# EAGLE design MinieasyMySens-V02-Build008 (EAGLE 7.6.0)
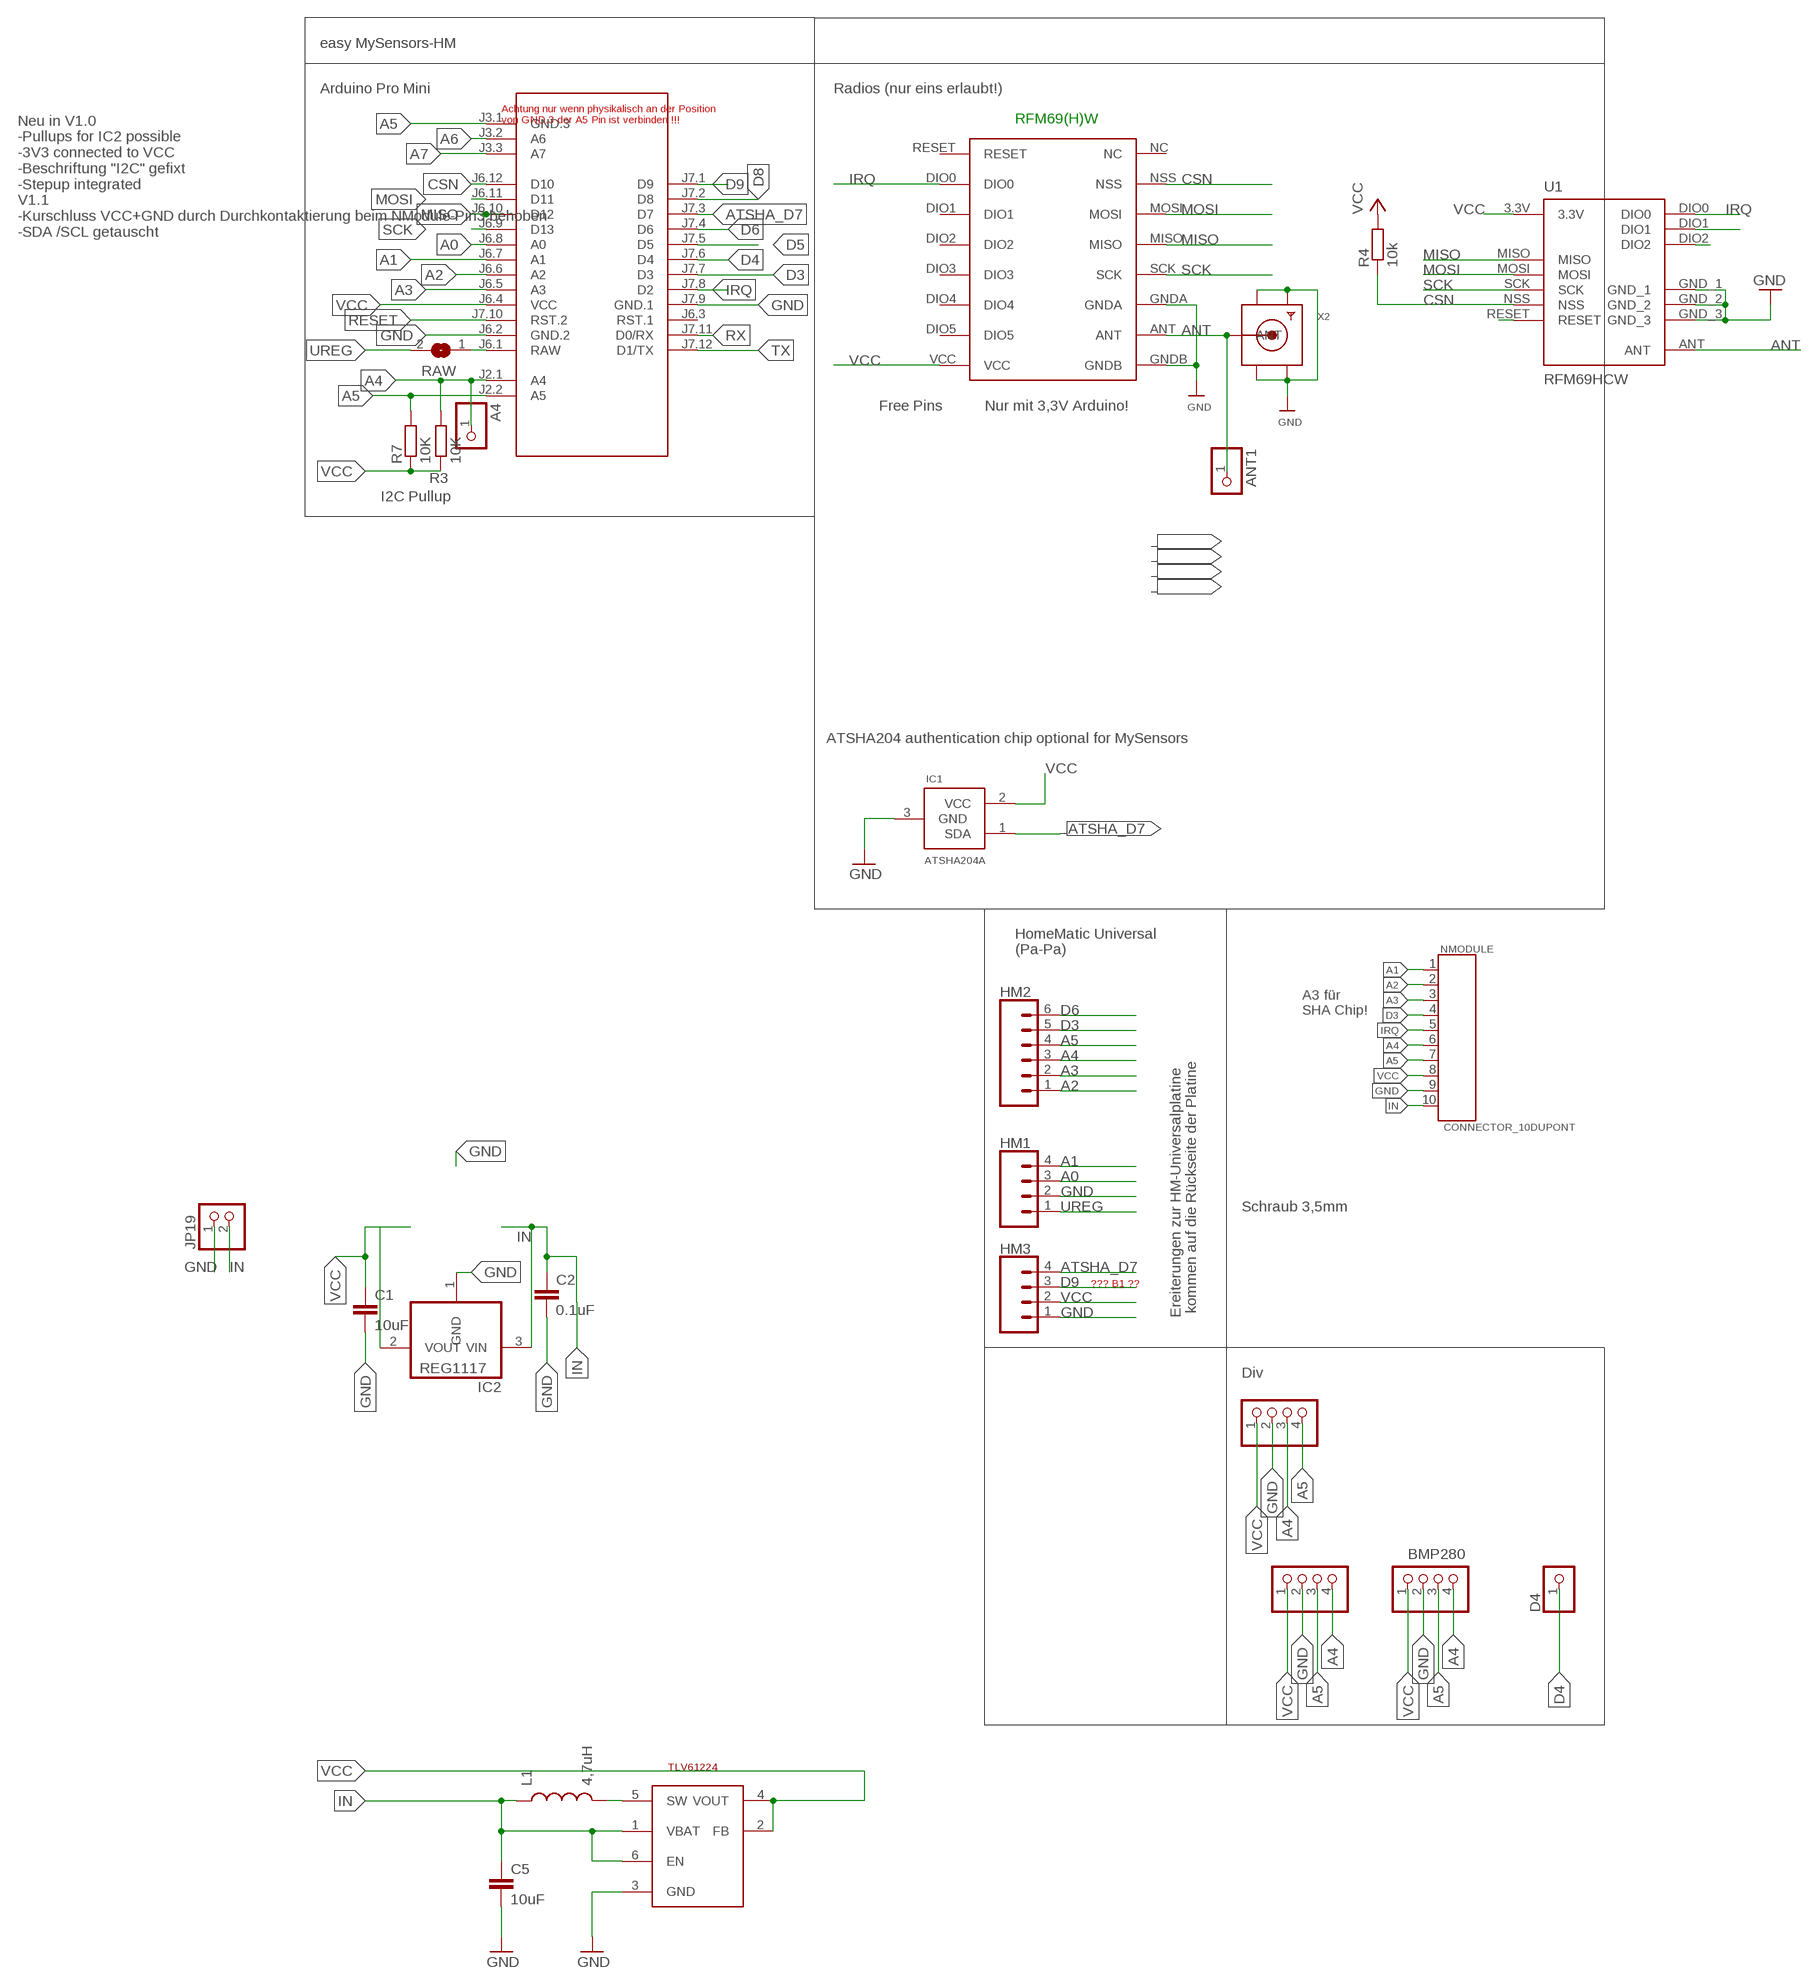
[diagram p0: schematic, sheet 1]

## Parts
A4  PINHD-1X1  [1X01]
ANT1  PINHD-1X1  [1X01]
BH1750  PINHD-1X04_2.54-S  [1X04-S]
C1  10uF  C-EUC1210  [C1210]
C2  0.1uF  C-EUC1206  [C1206]
C5  10uF  CAP0805  [0805]
D4  PINHD-1X1  [1X01]
HM1  CONN_04  [1X04]
HM2  CONN_06SILK_FEMALE_PTH  [1X06]
HM3  CONN_04  [1X04]
I2C-1  PINHD-1X04_2.54-S  [1X04-S]
I2C-2  PINHD-1X04_2.54-S  [1X04-S]
IC1  ATSHA204A  [SOT23]
IC2  REG1117  [SOT223]
JP19  PINHD-1X2  [1X02]
L1  4,7uH  INDUCTOR0805  [0805]
M1  ARDUINO-PRO-MINI-3.3V#NP  [ARDUINO-PRO-MINI#NP]
NMODULE  CONNECTOR_10DUPONT  [DUPONT_10]
R3  10K  R-EU_R0805  [R0805]
R4  10k  R-EU_M0805  [M0805]
R7  10K  R-EU_R0805  [R0805]
RAW  SJ  [SJ]
RFM69W  RFM69HW  [RFM]
STEPUP  TLV61224  TI-TLV61224  [SOT23-6L]
U1  RFM69HCW  [RFM69HCW-XXXS2]
X2  SMACONNECTOR_EDGE  [SMA_EDGELAUNCH]

## Nets
A0: HM1.3 M1.J6.8(A0)
A1: HM1.4 M1.J6.7(A1) NMODULE.1
A2: HM2.1 M1.J6.6(A2) NMODULE.2
A3: HM2.2 M1.J6.5(A3) NMODULE.3
A4: A4.1 BH1750.4 HM2.3 I2C-1.4 I2C-2.3 M1.J2.1(A4) NMODULE.6 R3.2
A5: BH1750.3 HM2.4 I2C-1.3 I2C-2.4 M1.J2.2(A5) M1.J3.1(GND.3) NMODULE.7 R7.2
A6: M1.J3.2(A6)
A7: M1.J3.3(A7)
ANT: ANT1.1 RFM69W.ANT U1.ANT X2.P(ANT)
ATSHA_D7: HM3.4 IC1.1(SDA) M1.J7.3(D7)
CSN: M1.J6.12(D10) R4.1 RFM69W.NSS U1.NSS
D3: HM2.5 M1.J7.7(D3) NMODULE.4
D4: D4.1 M1.J7.6(D4)
D5: M1.J7.5(D5)
D6: HM2.6 M1.J7.4(D6)
D8: M1.J7.2(D8)
D9: HM3.3 M1.J7.1(D9)
GND [Power]: BH1750.2 C1.2 C2.2 C5.2 HM1.2 HM3.1 I2C-1.2 I2C-2.2 IC1.3(GND) IC2.1(GND) JP19.1 M1.J6.2(GND.2) M1.J7.9(GND.1) NMODULE.9 RFM69W.GNDA RFM69W.GNDB STEPUP.3(GND) U1.GND_1 U1.GND_2 U1.GND_3 X2.GND@1(GND4) X2.GND@2(GND3) X2.GND@3(GND2) X2.GND@4(GND1)
IN [Power]: C2.1 C5.1 IC2.3(VIN) JP19.2 L1.1 NMODULE.10 STEPUP.1(VBAT) STEPUP.6(EN)
IRQ: M1.J7.8(D2) NMODULE.5 RFM69W.DIO0 U1.DIO0
MISO: M1.J6.10(D12) RFM69W.MISO U1.MISO
MOSI: M1.J6.11(D11) RFM69W.MOSI U1.MOSI
N$1: U1.RESET
N$13: L1.2 STEPUP.5(SW)
N$14: U1.DIO2
N$15: U1.DIO1
RAW [Power]: M1.J6.1(RAW) RAW.1
RESET: M1.J7.10(RST.2)
RX: M1.J7.11(D0/RX)
SCK: M1.J6.9(D13) RFM69W.SCK U1.SCK
TX: M1.J7.12(D1/TX)
UREG [Power]: HM1.1 RAW.2
VCC [Power]: BH1750.1 C1.1 HM3.2 I2C-1.1 I2C-2.1 IC1.2(VCC) IC2.2(VOUT) M1.J6.4(VCC) NMODULE.8 R3.1 R4.2 R7.1 RFM69W.VCC STEPUP.2(FB) STEPUP.4(VOUT) U1.3.3V
Unconnected: M1.J6.3(RST.1) RFM69W.DIO1 RFM69W.DIO2 RFM69W.DIO3 RFM69W.DIO4 RFM69W.DIO5 RFM69W.NC RFM69W.RESET

## Notes on the sheet
- easy MySensors-HM
- Arduino Pro Mini | Radios (nur eins erlaubt!)
- Achtung nur wenn physikalisch an der Position 
  von GND.3 der A5 Pin ist verbinden !!!
- RFM69(H)W
- Neu in V1.0
  -Pullups for IC2 possible
  -3V3 connected to VCC
  -Beschriftung "I2C" gefixt
  -Stepup integrated
  V1.1
  -Kurschluss VCC+GND durch Durchkontaktierung beim NModule-Pin3 behoben
  -SDA /SCL getauscht
- Free Pins | Nur mit 3,3V Arduino!
- I2C Pullup
- ATSHA204 authentication chip optional for MySensors
- HomeMatic Universal
  (Pa-Pa)
- A3 für 
  SHA Chip!
- Schraub 3,5mm
- ??? B1 ??
- Ereiterungen zur HM-Universalplatine
   kommen auf die Rückseite der Platine
- Div
- BMP280

## Library data of the parts
A4 ANT1 D4 = pinhead:PINHD-1X1: PIN HEADER
BH1750 I2C-1 I2C-2 = pinhead-2:PINHD-1X04: PIN HEADER
C1 C2 = rcl:C-EU: CAPACITOR, European symbol
C5 = SparkFun-Passives:CAP: Capacitor Standard 0603 ceramic capacitor, and 0.1" leaded capacitor.
HM1 HM3 = SparkFun-Connectors:CONN_04: Multi connection point. Often used as Generic Header-pin footprint for 0.1 inch spaced/style header connections On any of the 0.1 inch spaced packages, you can populate with these: Break Away Headers - Straight <https://www.sparkfun.com/products/116> (PRT-00116) Break Away Male Headers - Right Angle <https://www.sparkfun.com/products/553> (PRT-00553) Female Headers <https://www.sparkfun.com/products/115> (PRT-00115) Break Away Headers - Machine Pin <https://www.sparkfun.com/products/117> (PRT-00117) Break Away Female Headers - Swiss Machine Pin <https://www.sparkfun.com/products/743> (PRT-00743) For SCREWTERMINALS and SPRING TERMINALS visit here: Screw Terimnals on SparkFun.com <https://www.sparkfun.com/search/results?term=Screw+Terminals> (5mm/3.5mm/2.54mm spacing) This device is also useful as a general connection point to wire up your design to another part of your project. Our various solder wires solder well into these plated through hole pads. Hook-Up Wire - Assortment (Stranded, 22 AWG) <https://www.sparkfun.com/products/11375> (PRT-11375) Hook-Up Wire - Assortment (Solid Core, 22 AWG) <https://www.sparkfun.com/products/11367> (PRT-11367) View the entire wire category on our website here <https://www.sparkfun.com/categories/141> Special notes: Molex polarized connector foot print use with SKU : PRT-08231 with associated crimp pins and housings. 1MM SMD Version SKU: PRT-10208; PROD_ID: CONN-09696
HM2 = SparkFun-Connectors:CONN_06: Multi connection point. Often used as Generic Header-pin footprint for 0.1 inch spaced/style header connections On any of the 0.1 inch spaced packages, you can populate with these: Break Away Headers - Straight <https://www.sparkfun.com/products/116> (PRT-00116) Break Away Male Headers - Right Angle <https://www.sparkfun.com/products/553> (PRT-00553) Female Headers <https://www.sparkfun.com/products/115> (PRT-00115) Break Away Headers - Machine Pin <https://www.sparkfun.com/products/117> (PRT-00117) Break Away Female Headers - Swiss Machine Pin <https://www.sparkfun.com/products/743> (PRT-00743) Arduino Stackable Header - 6 Pin <https://www.sparkfun.com/products/9280> (PRT-09280) For SCREWTERMINALS and SPRING TERMINALS visit here: Screw Terimnals on SparkFun.com <https://www.sparkfun.com/search/results?term=Screw+Terminals> (5mm/3.5mm/2.54mm spacing) This device is also useful as a general connection point to wire up your design to another part of your project. Our various solder wires solder well into these plated through hole pads. Hook-Up Wire - Assortment (Stranded, 22 AWG) <https://www.sparkfun.com/products/11375> (PRT-11375) Hook-Up Wire - Assortment (Solid Core, 22 AWG) <https://www.sparkfun.com/products/11367> (PRT-11367) View the entire wire category on our website here <https://www.sparkfun.com/categories/141>; PROD_ID: CONN-08437
IC1 = Sensor:ATSHA204A
IC2 = burr-brown:REG1117: 800mA and 1A Low Dropout (LDO) Positive Regulator 1.8V, 2.5V, 2.85V, 3.3V, 5V, and Adj; MPN: REG1117; OC_FARNELL: 1097566; OC_NEWARK: 14P6981
JP19 = pinhead:PINHD-1X2: PIN HEADER
L1 = SparkFun-Passives:INDUCTOR: Inductors Basic Inductor/Choke - 0603 and 1206. Footprints are not proven and vary greatly between part numbers.
M1 = diy-modules:ARDUINO-PRO-MINI-*#NP: Arduino Pro Mini without programming pads
NMODULE = TD-MySensors:CONNECTOR_10
R3 R4 R7 = rcl:R-EU_: RESISTOR, European symbol
RAW = jumper:SJ: SMD solder JUMPER
RFM69W = hoperf:RFM69HW
STEPUP = TLV61224:TI-TLV61224
U1 = doug:RFM69H
X2 = adafruit:SMACONNECTOR: SMA Connector 90° DIP SMA Connector, 50 Ohm (4UConnector: 07259)

## Net classes
0 default: width 0.305 mm
1 Power: width 0.508 mm

## Board
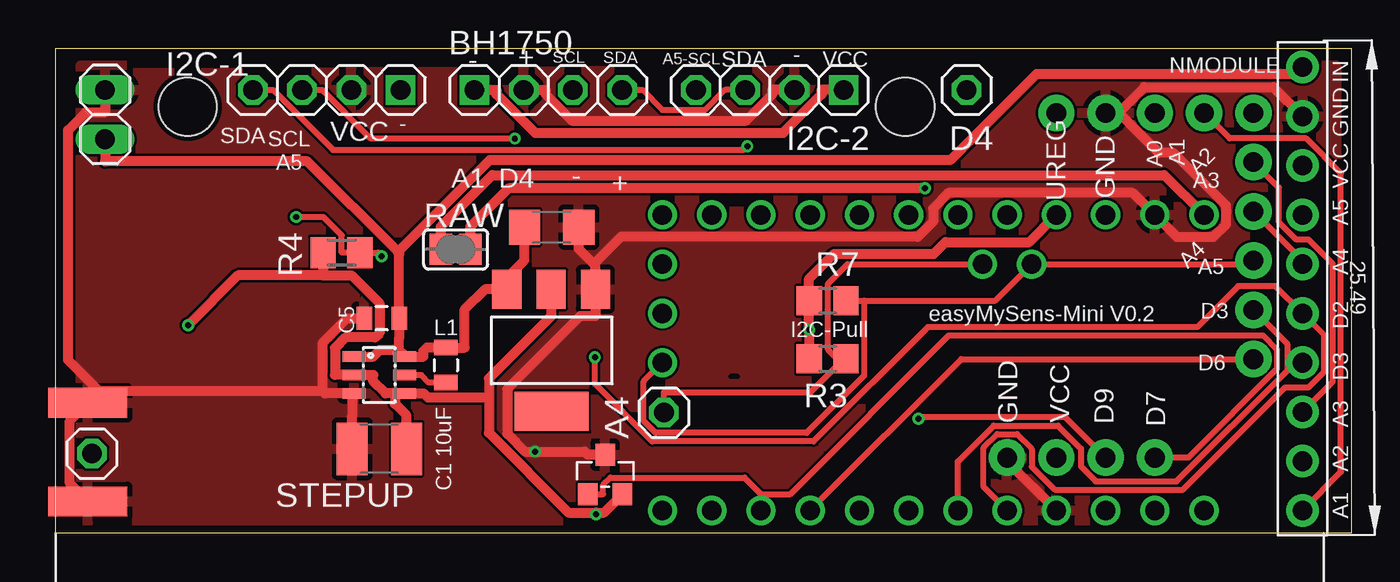
[diagram p1: board, top side]
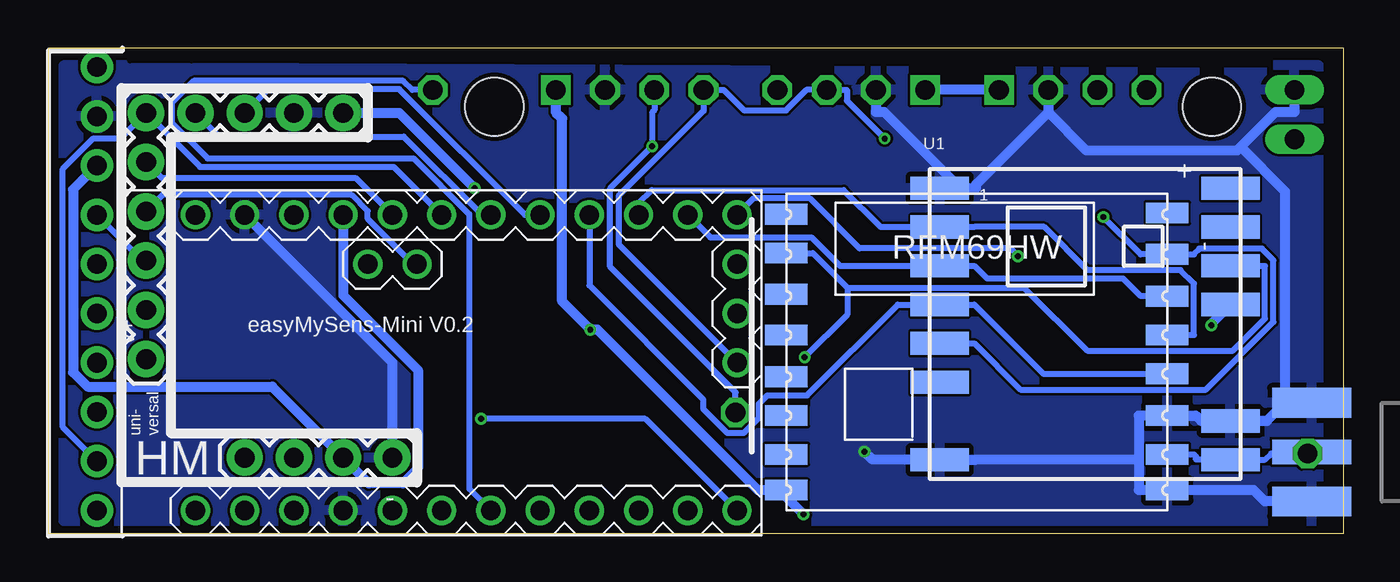
[diagram p2: board, bottom side, seen from below]

Size 66.81 x 25 mm. Coordinates in mm from the lower left corner, seen from the top.
Outline: 66.81,0 0,0 0,25 66.81,25 66.81,0
Copper layers (1*16): Top 0.035mm / dielectric 1.5mm / Bottom 0.035mm
Design rules "dirt_cheap_dirty_boards.v1": minimum track width 5mil, minimum drill 12mil, track to track 5mil, track to pad 5mil, pad to pad 5mil, via to via 5mil, smd to smd 0mil, copper to edge 10mil, drill to drill 10mil, minimum pad ring 10mil, minimum via ring 6mil, stop-mask expansion 2mil, vias tented up to drill 25mil, thermal gap 10mil
Holes 3 mm at 6.81,22 43.81,22
tRestrict: area 3.8,24.1 to 62.9,25.4; 2 lines
bRestrict: area 3.8,24.1 to 62.6,25.4; 2 lines

### Footprints (pad centres in the part's own frame; a part is rotated, then mirrored left to right if it is on the bottom)
1X01 = drill 1.016 octagon: 1 0,0
1X04-S = drill 1.016 square: 1 -3.81,0 | drill 1.016 octagon: 2 -1.27,0; 3 1.27,0; 4 3.81,0
C1210 = smd 1.6 x 2.7: 1 -1.4,0; 2 1.4,0
C1206 = smd 1.6 x 1.8: 1 -1.4,0; 2 1.4,0
0805 = smd 0.8 x 1.2: 1 -0.9,0; 2 0.9,0
1X04 = drill 1.016 pad 1.88: 1 0,0; 2 2.54,0; 3 5.08,0; 4 7.62,0
1X06 = drill 1.016 pad 1.88: 1 0,0; 2 2.54,0; 3 5.08,0; 4 7.62,0; 5 10.16,0; 6 12.7,0
SOT23 = smd 1.016 x 1.143: 1 -0.889,-1.016; 2 0.889,-1.016; 3 0,1.016
SOT223 = smd 1.499 x 2.007: 1 -2.261,-3.15; 2 0.025,-3.15; 3 2.311,-3.15 | smd 3.81 x 2.007: 4 0,3.15
1X02 = drill 1.016 long: 1 -1.27,0; 2 1.27,0
ARDUINO-PRO-MINI#NP = drill 1: J2.1 -1.27,5.08; J2.2 -3.81,5.08; J3.1 15.24,0; J3.2 15.24,2.54; J3.3 15.24,5.08; J6.1 -12.7,7.62; J6.2 -10.16,7.62; J6.3 -7.62,7.62; J6.4 -5.08,7.62; J6.5 -2.54,7.62; J6.6 0,7.62; J6.7 2.54,7.62; J6.8 5.08,7.62; J6.9 7.62,7.62; J6.10 10.16,7.62; J6.11 12.7,7.62; J6.12 15.24,7.62; J7.1 15.24,-7.62; J7.2 12.7,-7.62; J7.3 10.16,-7.62; J7.4 7.62,-7.62; J7.5 5.08,-7.62; J7.6 2.54,-7.62; J7.7 0,-7.62; J7.8 -2.54,-7.62; J7.9 -5.08,-7.62; J7.10 -7.62,-7.62; J7.11 -10.16,-7.62; J7.12 -12.7,-7.62
DUPONT_10 = drill 1.016 pad 1.676: 1 1.27,1.27; 2 3.81,1.27; 3 6.35,1.27; 4 8.89,1.27; 5 11.43,1.27; 6 13.97,1.27; 7 16.51,1.27; 8 19.05,1.27; 9 21.59,1.27; 10 24.13,1.27
R0805 = smd 1.3 x 1.5: 1 -0.95,0; 2 0.95,0
M0805 = smd 1.3 x 1.6: 1 -0.95,0; 2 0.95,0
SJ = smd 1.168 x 1.6: 1 -0.762,0; 2 0.762,0
RFM = smd 2.184 x 1.067: ANT 19.651,2.889; DIO0 0,13.27; DIO1 0,11.143; DIO2 0,9.047; DIO3 0,6.889; DIO4 0,4.889; DIO5 0,2.889; GNDA 19.651,4.889; GNDB 19.651,1.048; MISO 19.651,9.047; MOSI 19.651,11.047; NC 19.651,15.334; NSS 19.651,13.206; RESET 0,15.27; SCK 19.651,7.048; VCC 0,1.048
SOT23-6L = smd 0.55 x 1.2: 1 -0.95,-1.3; 2 0,-1.3; 3 0.95,-1.3; 4 0.95,1.3; 5 0,1.3; 6 -0.95,1.3
RFM69HCW-XXXS2 = smd 3 x 1.2: 3.3V 7.5,1; ANT 7.5,-7; DIO0 7.5,3; DIO1 7.5,5; DIO2 7.5,7; GND_1 7.5,-5; GND_2 -7.5,-7; GND_3 -7.5,7; MISO -7.5,5; MOSI -7.5,3; NSS -7.5,-1; RESET -7.5,-3; SCK -7.5,1
SMA_EDGELAUNCH = smd 4.064 x 1.524: GND@1 2.032,-2.54; GND@2 2.032,2.54 | smd 4.064 x 1.524 bottom: GND@3 2.032,2.54; GND@4 2.032,-2.54 | smd 4.064 x 1.27: P 2.032,0

### Placement (x,y rotation side)
A4  31.37,6.22 90 top
ANT1  1.87,4.11 90 top
BH1750  25.4,22.86 0 top
C1  16.68,4.36 180 top
C2  25.57,15.79 0 top
C5  16.81,11.09 180 top
D4  46.99,22.86 180 top
HM1  51.61,21.68 180 bottom
HM2  61.77,21.68 270 bottom
HM3  49.07,3.9 180 bottom
I2C-1  13.97,22.86 180 top
I2C-2  36.83,22.86 180 top
IC1  28.33,3.04 0 top
IC2  25.57,9.44 180 top
JP19  2.54,21.59 270 top
L1  20.11,8.67 270 top
M1  46.53,8.8 0 bottom
NMODULE  65.58,-0.09 90 top
R3  39.81,9 0 top
R4  14.73,14.48 180 top
R7  39.81,12 0 top
RAW  20.62,14.64 0 top
RFM69W  28.75,1.18 0 bottom
STEPUP  16.68,8.16 270 top
U1  13.34,10.79 0 bottom
X2  -0.38,4.19 180 bottom

### Tracks (layer width: path | path; a pad name or v marks a point on that pad's centre or on a via)
A0
  Bottom 0.305: M1.J6.8 42.24,16.42 48.72,22.9 55.47,22.9 HM1.3
A1
  Top 0.305: NMODULE.1 66.29,3.16 66.29,18.56 64.49,20.36 60.55,20.36 HM1.4
  Bottom 0.305: HM1.4 58.01,20.46 48.49,20.46 44.45,16.42 M1.J6.7
A2
  Bottom 0.305: M1.J6.6 49.01,18.89 58.98,18.89 HM2.1 63.09,20.36 64.5,20.36 66.07,18.79 66.07,5.48 NMODULE.2
A3
  Top 0.305: NMODULE.3 65.86,7.81 65.86,13.91 64.62,15.15 63.99,15.15 63.09,16.05 63.09,17.82 HM2.2
  Bottom 0.305: HM2.2 60.96,18.33 50.98,18.33 M1.J6.5
A4  (via drill 0.3 pad 0.61)
  Top 0.305: v35.67,19.96 35.48,19.77 14.29,19.77 11.2,22.86 I2C-1.4 | BH1750.4 30.25,22.86 31.29,21.82 33.48,21.82 34.52,22.86 I2C-2.3 | 40.3,9 40.3,8.63 38.93,7.26 31.37,7.26 A4.1 | HM2.3 64.31,14.06 NMODULE.6 | 40.3,9 39.83,9.46 39.83,12.88 40.84,13.88 M1.J2.1 | R3.2 40.3,9
  Bottom 0.305: I2C-2.3 35.56,21.82 35.67,21.71 v35.67,19.96 37.84,17.79 37.84,13.73 31.37,7.26 A4.1 | M1.J2.1 48,13.88 50.34,16.22 50.34,16.61 51.18,17.45 60.92,17.45 HM2.3
A5  (via drill 0.3 pad 0.61)
  Top 0.305: 41.69,12 48.46,12 M1.J2.2 61.59,13.88 HM2.4 | R7.2 41.69,12 | 41.69,12 41.69,8.13 38.73,5.18 30.94,5.18 30.32,5.8 30.32,7.83 M1.J3.1 | v23.67,20.36 16.25,20.36 13.74,22.86 I2C-1.3
  Bottom 0.305: M1.J3.1 37.4,14.91 37.4,17.4 33.02,21.78 33.02,21.82 I2C-2.4 31.98,22.86 30.93,21.81 28.76,21.81 27.71,22.86 BH1750.3 25.63,22.86 25.63,22.31 v23.67,20.36 | NMODULE.7 61.95,14.06 HM2.4
ANT
  Bottom 0.305: X2.P 1.79,4.19 ANT1.1 3.74,4.11 4.06,3.79 U1.ANT 7.61,3.79 7.61,3.96 7.73,4.07 RFM69W.ANT
ATSHA_D7
  Top 0.305: 36.37,2.02 37.88,2.02 46.06,10.2 62.28,10.2 62.99,9.49 62.99,8.47 58.42,3.9 HM3.4 | 36.37,2.02 35.52,2.87 28.6,2.87 28.23,2.5 28.23,2.02 IC1.1 | M1.J7.3 36.37,2.02
CSN  (via drill 0.3 pad 0.61)
  Top 0.305: v12.39,16.31 13.8,16.31 14.75,15.36 14.75,14.48 R4.1 16.61,14.48 v16.8,14.29
  Bottom 0.305: v12.39,16.31 10.47,14.39 RFM69W.NSS 8.41,14.39 7.73,14.39 7.73,14.4 7.46,14.67 4.22,14.67 3.62,14.07 3.62,10.9 7.11,7.41 16.67,7.41 19.06,9.79 U1.NSS | v16.8,14.29 17.19,14.69 24.96,14.69 27.54,17.27 30.45,17.27 M1.J6.12
D3
  Top 0.305: M1.J7.7 46.53,3.7 48.38,5.55 51.69,5.55 52.88,4.36 52.88,3.44 53.65,2.68 57.81,2.68 63.54,8.41 63.54,8.8 | 63.54,8.8 63.54,9.75 HM2.5 | NMODULE.4 63.54,8.8
D4
  Bottom 0.305: M1.J7.6 45.11,2.3 45.11,16.46 47.98,19.33 58.6,19.33 60.45,21.18 60.45,22.19 59.31,23.33 48.5,23.33 48.03,22.86 D4.1
D6
  Top 0.305: M1.J7.4 46.71,8.98 HM2.6
D9  (via drill 0.3 pad 0.61)
  Top 0.305: HM3.3 52.07,5.99 44.57,5.99 v44.49,5.9
  Bottom 0.305: M1.J7.1 36.01,5.9 v44.49,5.9
GND  (via drill 0.3 pad 0.61)
  Top 0.508: 27.84,13.97 27.84,13.28 IC2.1 27.84,11.2 27.04,11.2 23.29,7.45 23.29,5.12 24.2,4.21 v24.71,4.21 27.28,4.21 27.45,4.05 IC1.3 | I2C-2.2 36.96,22.86 36.96,22.64 35.6,21.28 26.63,21.28 25.27,22.64 25.27,22.86 BH1750.2 | C2.2 26.97,14.66 27.67,13.97 27.84,13.97 | X2.GND@3 0.72,2.58 0.72,5.8 X2.GND@1 2.24,7.32 | 13.77,7.32 13.77,9.82 15.03,11.09 C5.2 | 15.29,7.21 13.87,7.21 13.77,7.32 | 13.77,7.32 2.24,7.32 | 2.24,7.32 0.63,8.93 0.63,20.79 1.56,21.72 2.54,21.72 JP19.1 | 54.82,21.68 56.15,23 62.81,23 NMODULE.9 | HM1.2 54.82,21.68 | 54.82,21.68 56.89,19.61 57.64,19.61 60.37,16.89 60.37,15.95 59.7,15.28 57.83,15.28 M1.J6.2 55.55,17.55 46.05,17.55 45.26,16.76 45.26,16.08 44.46,15.28 29.15,15.28 27.84,13.97 | STEPUP.3 15.29,7.21 | 15.29,7.21 15.29,6.09 C1.2 | HM3.1 49.07,3.72 M1.J7.9
  Bottom 0.508: BH1750.2 24.13,21.72 23.7,21.72 19.77,17.8 | 19.77,17.8 18.95,17.8 18.95,18 15.24,21.72 | U1.GND_3 19.77,17.8 | 10.57,3.79 10.57,2.23 RFM69W.GNDB 4.64,2.23 4.06,1.65 X2.GND@3 | 10.57,3.79 10.57,6.07 RFM69W.GNDA 8.36,6.07 7.63,6.07 7.35,5.79 U1.GND_1 3.95,5.79 3.02,6.73 | 10.57,3.79 18.95,3.79 U1.GND_2 24.29,3.79 v24.71,4.21 | HM3.1 49.07,8.8 M1.J6.2 | 5.32,19.92 5.5,19.74 13.26,19.74 15.24,21.72 | 3.02,6.73 3.02,17.62 5.32,19.92 | 5.32,19.92 3.52,21.72 2.54,21.72 JP19.1 | 3.02,6.73 2.75,6.73 X2.GND@1 | I2C-1.2 15.24,21.72
  pour Top: 1.27,0.64 1.27,24.13 66.04,24.13 66.04,0.64
  pour Bottom: 1.27,0.64 1.27,24.13 66.04,24.13 66.04,0.64
IN
  Top 0.508: 17.64,14.51 12.97,19.18 2.54,19.18 JP19.2 | 17.64,14.51 17.71,14.44 C5.1 17.71,10.6 17.71,10.11 17.71,9.45 | NMODULE.10 63.95,23.68 50.58,23.68 46.14,19.24 22.37,19.24 17.64,14.51 | 17.71,9.45 16.7,9.45 16.37,9.12 STEPUP.1 | 17.71,9.45 17.98,9.18 STEPUP.6 18.03,9.12 18.97,9.12 18.97,9.41 19.13,9.57 19.62,9.57 L1.1 21.09,9.57 21.09,11.55 22.13,12.59 IC2.3 23.26,13.18 24.17,14.09 C2.1
IRQ  (via drill 0.3 pad 0.61)
  Top 0.305: v27.8,9.08 27.8,7.7 30.76,4.74 39.09,4.74 44.98,10.63 58.88,10.63 60.98,12.74 62.91,12.74 NMODULE.5 65.43,10.22 65.43,8.34 64.62,7.53 63.42,7.53 58.14,2.25 51.53,2.25 50.34,3.44 50.34,4.36 49.58,5.12 48.56,5.12 47.85,4.41 47.85,2.4 M1.J7.8
  Bottom 0.305: 25.6,12.67 25.6,11.28 v27.8,9.08 | 25.6,12.67 16.49,12.67 13.23,9.41 5.71,9.41 4.06,11.07 4.06,13.79 U1.DIO0 | 25.6,12.67 27.38,14.45 RFM69W.DIO0
MISO
  Bottom 0.305: RFM69W.MISO 7.73,10.23 7.73,12.88 8.42,13.57 13.22,13.57 15.44,15.79 19.06,15.79 U1.MISO 23.89,15.79 25.8,17.7 35.68,17.7 36.37,17.02 M1.J6.10
MOSI
  Bottom 0.305: RFM69W.MOSI 10.47,12.23 11.38,13.14 18.4,13.14 19.06,13.79 U1.MOSI 25.97,13.79 27.44,15.26 32.67,15.26 M1.J6.11
N$13
  Top 0.305: STEPUP.5 18.86,8.16 18.86,8.14 19.23,7.77 L1.2
RAW
  Top 0.508: RAW.1 19.86,15.82 22.51,18.47 57.18,18.47 M1.J6.1
SCK
  Bottom 0.305: RFM69W.SCK 15.49,8.23 19.06,11.79 U1.SCK 23,11.79 27.68,7.12 29.72,7.12 30.16,6.68 30.16,5.95 30.93,5.18 31.8,5.18 33.04,6.42 33.04,6.91 38.91,12.78 M1.J6.9
UREG  (via drill 0.3 pad 0.61)
  Top 0.508: v44.83,17.79 23.35,17.79 21.38,15.82 RAW.2
  Bottom 0.508: HM1.1 48.72,21.68 v44.83,17.79
VCC  (via drill 0.3 pad 0.61)
  Top 0.508: v27.86,0.97 27.86,1.07 | 27.86,1.07 28.27,1.07 IC1.2 | 22.34,6.99 22.34,5.17 26.45,1.07 27.86,1.07 | 22.34,6.99 19.19,6.99 18.97,7.21 STEPUP.4 17.49,7.21 | 22.34,6.99 22.34,7.99 25.55,11.2 IC2.2 | M1.J6.4 50.21,15.02 45.89,15.02 45.29,14.41 40.14,14.41 38.86,13.13 R7.1 v38.86,10.5 R3.1 | BH1750.1 22.73,22.86 22.73,22.64 24.72,20.65 37.51,20.65 39.5,22.64 39.5,22.86 I2C-2.1 | 13.78,13.3 9.38,13.3 v6.82,10.73 | R4.2 13.78,13.3 | 13.78,13.3 15.25,13.3 16.69,11.85 16.69,10.33 16.46,10.1 14.95,10.1 14.4,9.55 14.4,8.16 STEPUP.2 16.37,8.16 16.37,7.85 17,7.21 17.49,7.21 | C1.1 18.09,6.09 17.49,6.68 17.49,7.21
  Bottom 0.508: 29.07,2.23 29.07,2.19 v27.86,0.97 | 29.07,2.23 29.39,2.23 29.49,2.23 30.22,2.23 38.5,10.5 v38.86,10.5 40.32,11.96 40.32,21.39 40.64,21.72 I2C-2.1 | RFM69W.VCC 29.07,2.23 | M1.J6.4 51.61,12.28 47.75,8.41 47.75,3.35 48.52,2.58 50.29,2.58 HM3.2 55.27,7.56 64.8,7.56 65.53,8.3 65.53,17.74 NMODULE.8 | U1.3.3V 6.82,10.81 v6.82,10.73 | I2C-1.1 BH1750.1

### Text on the board
tPlace: I2C-Pull | easyMySens-Mini V0.2
bPlace: easyMySens-Mini V0.2 | HM | uni- / versal
tNames: - | + | SCL | SDA | SDA | A5-SCL | - | VCC | IN | - | UREG | GND | SDA | SCL / A5 | VCC | A0 | A1 | GND | A1 | D4 | - | + | A3 | A2 | VCC | A5 | A4 | A5 | A4 | D3 | D2 | D6 | D3 | GND | VCC | D9 | D7 | A3 | A2 | C1 10uF | A1 | +
bNames: + | - | V+ | -